# EAGLE design HarpTransistors (EAGLE 7.5.0)
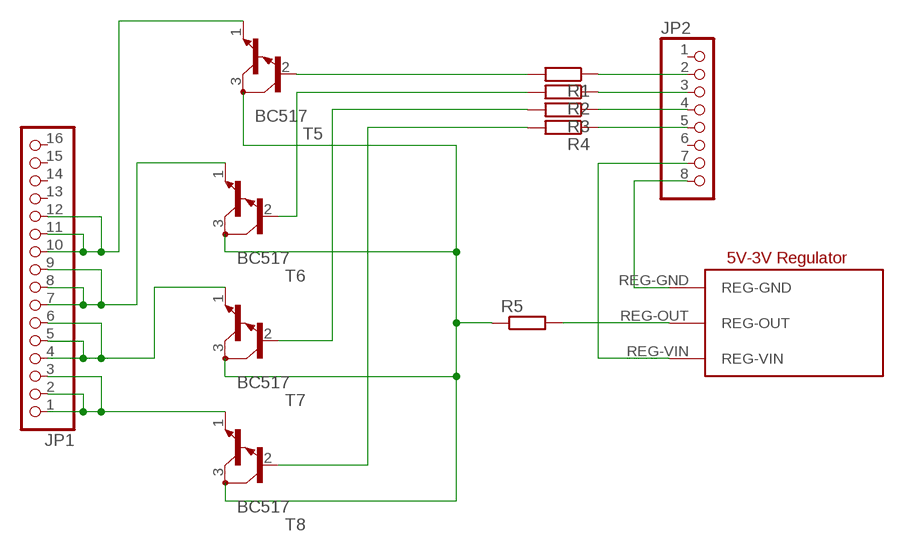
[diagram p0: schematic, sheet 1]

## Parts
JP1  PINHD-1X16  [1X16]
JP2  PINHD-1X8  [1X08]
R1  R-EU_0204/5  [0204/5]
R2  R-EU_0204/5  [0204/5]
R3  R-EU_0204/5  [0204/5]
R4  R-EU_0204/5  [0204/5]
R5  R-EU_0204/5  [0204/5]
T5  BC517  [TO92]
T6  BC517  [TO92]
T7  BC517  [TO92]
T8  BC517  [TO92]
U$1  5V-TO-3V-REG-DEV  [5V-TO-3V-REG-PAC]

## Nets
N$1: R1.2 T5.2(B)
N$2: JP2.5 R4.1
N$3: JP2.4 R3.1
N$4: JP2.3 R2.1
N$5: JP2.2 R1.1
N$6: R4.2 T8.2(B)
N$7: R2.2 T6.2(B)
N$8: JP2.8 U$1.REG-GND
N$10: JP1.4 JP1.5 JP1.6 T7.1(E)
N$11: JP1.7 JP1.8 JP1.9 T6.1(E)
N$12: JP1.10 JP1.11 JP1.12 T5.1(E)
N$13: R5.1 T5.3(C) T6.3(C) T7.3(C) T8.3(C)
N$15: JP1.1 JP1.2 JP1.3 T8.1(E)
N$16: R3.2 T7.2(B)
N$17: JP2.7 U$1.REG-VIN
N$18: R5.2 U$1.REG-OUT
Unconnected: JP1.13 JP1.14 JP1.15 JP1.16 JP2.1 JP2.6

## Library data of the parts
JP1 = pinhead:PINHD-1X16: PIN HEADER
JP2 = pinhead:PINHD-1X8: PIN HEADER
R1-R5 = resistor:R-EU_: RESISTOR, European symbol
T5-T8 = transistor:BC517: NPN BIPOLAR DARLINGTON TRANSISTOR
U$1 = Dr_Burrows_library:5V-TO-3V-REG-DEV: 5v to 3v Regulator

## Board
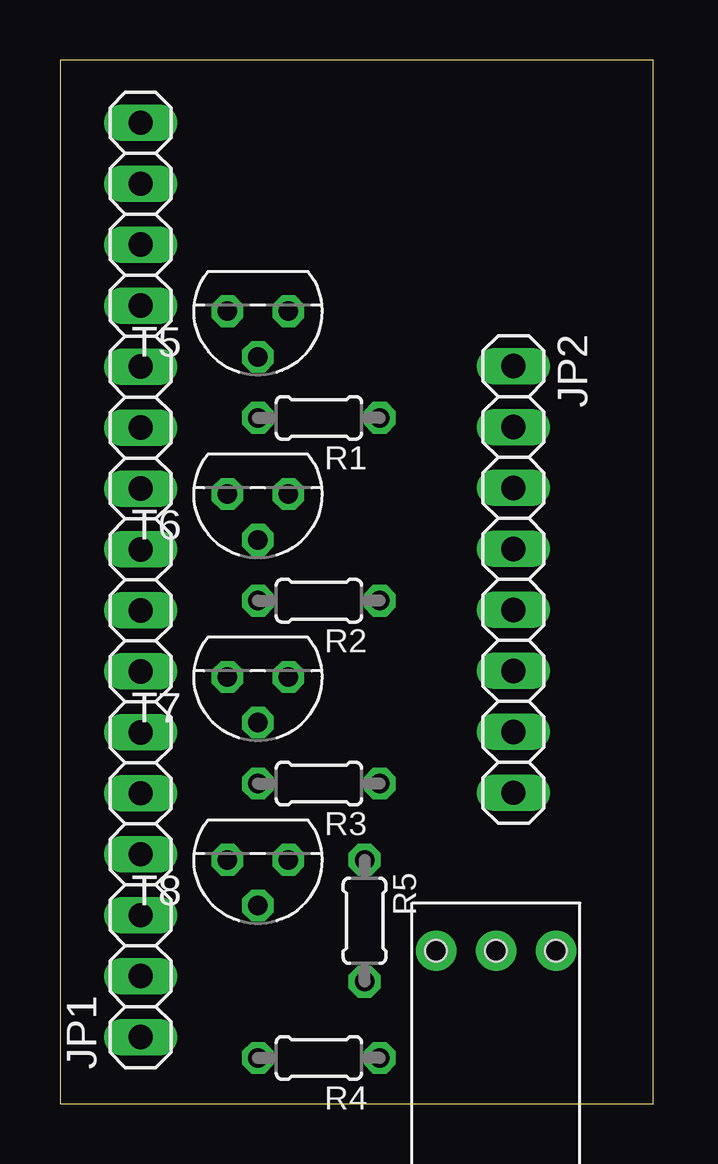
[diagram p1: board, top side]
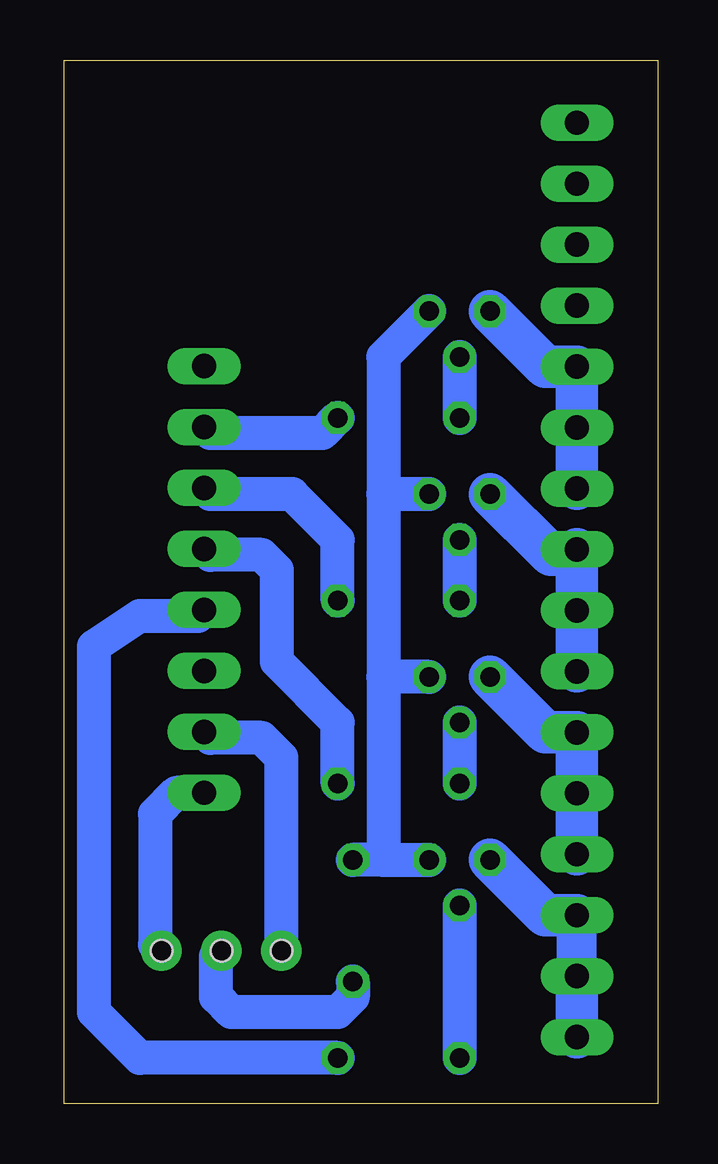
[diagram p2: board, bottom side, seen from below]

Size 24.75 x 43.48 mm. Coordinates in mm from the lower left corner, seen from the top.
Outline: 0,0 24.75,0 24.75,43.48 0,43.48 0,0
Copper layers (1*16): Top 0.035mm / dielectric 1.5mm / Bottom 0.035mm
Design rules "default *": minimum track width 10mil, minimum drill 24mil, track to track 8mil, track to pad 8mil, pad to pad 8mil, via to via 8mil, smd to smd 8mil, copper to edge 40mil, drill to drill 8mil, minimum pad ring 10mil, minimum via ring 8mil, stop-mask expansion 4mil, vias tented up to drill 0mil, thermal gap 10mil

### Footprints (pad centres in the part's own frame; a part is rotated, then mirrored left to right if it is on the bottom)
1X16 = drill 1.016 long: 1 -19.05,0; 2 -16.51,0; 3 -13.97,0; 4 -11.43,0; 5 -8.89,0; 6 -6.35,0; 7 -3.81,0; 8 -1.27,0; 9 1.27,0; 10 3.81,0; 11 6.35,0; 12 8.89,0; 13 11.43,0; 14 13.97,0; 15 16.51,0; 16 19.05,0
1X08 = drill 1.016 long: 1 -8.89,0; 2 -6.35,0; 3 -3.81,0; 4 -1.27,0; 5 1.27,0; 6 3.81,0; 7 6.35,0; 8 8.89,0
0204/5 = drill 0.813 octagon: 1 -2.54,0; 2 2.54,0
TO92 = drill 0.813 octagon: 1 1.27,0; 2 0,1.905; 3 -1.27,0
5V-TO-3V-REG-PAC = drill 0.8 pad 1.676: REG-GND 7,-1; REG-OUT 7,1.5; REG-VIN 7,4 | hole 0.9: 7,4; 7,-1; 7,1.5

### Placement (x,y rotation side)
JP1  3.36,21.82 90 top
JP2  18.91,21.84 270 top
R1  10.79,28.57 180 top
R2  10.79,20.95 180 top
R3  10.79,13.34 180 top
R4  10.79,1.91 180 top
R5  12.7,7.62 270 top
T5  8.26,33.02 180 top
T6  8.26,25.4 180 top
T7  8.26,17.78 180 top
T8  8.26,10.16 180 top
U$1  19.68,-0.63 90 top

### Tracks (layer width: path | path; a pad name or v marks a point on that pad's centre or on a via)
N$1
  Bottom 1.422: T5.2 R1.2
N$2
  Bottom 1.422: R4.1 21.59,1.91 23.5,3.81 23.5,19.05 21.59,20.32 19.16,20.32 JP2.5
N$3
  Bottom 1.422: R3.1 13.34,15.88 15.88,18.41 15.88,22.22 16.51,22.86 18.65,22.86 JP2.4
N$4
  Bottom 1.422: R2.1 13.34,23.5 15.24,25.4 18.65,25.4 JP2.3
N$5
  Bottom 1.422: R1.1 13.97,27.94 18.65,27.94 JP2.2
N$6
  Bottom 1.422: T8.2 R4.2
N$7
  Bottom 1.422: T6.2 R2.2
N$8
  Bottom 1.422: JP2.8 20.07,12.95 20.96,12.07 20.96,6.64 U$1.REG-GND
N$10
  Bottom 1.778: JP1.4 JP1.5 JP1.6 4.68,15.47 T7.1
N$11
  Bottom 1.676: 3.77,22.86 JP1.9
  Bottom 1.778: JP1.9 JP1.8 JP1.7 | 3.77,22.86 4.45,22.86 T6.1
N$12
  Bottom 1.778: JP1.10 JP1.11 JP1.12 4.68,30.71 T5.1
N$13
  Bottom 1.422: T5.3 11.43,31.11 11.43,25.4 | 11.43,25.4 11.43,17.78 | 11.43,17.78 11.43,10.16 | 11.43,10.16 T8.3 | T7.3 11.43,17.78 | T6.3 11.43,25.4 | 11.43,10.16 R5.1
N$15
  Bottom 1.676: JP1.2 JP1.3
  Bottom 1.778: JP1.1 JP1.2 | JP1.3 4.68,7.85 T8.1
N$16
  Bottom 1.422: T7.2 R3.2
N$17
  Bottom 1.422: U$1.REG-VIN 15.68,14.41 16.51,15.24 18.65,15.24 JP2.7
N$18
  Bottom 1.422: R5.2 12.7,4.45 13.34,3.81 17.78,3.81 18.41,4.45 18.41,6.14 U$1.REG-OUT